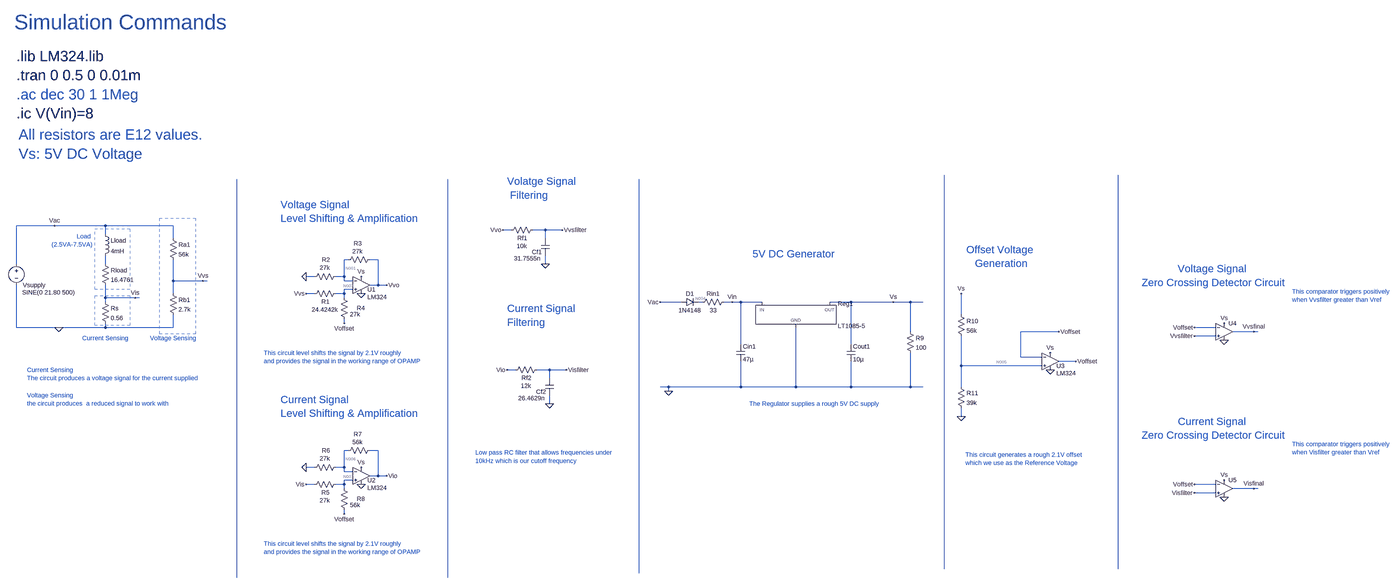
[diagram p0: schematic LTspice.asc, whole sheet]
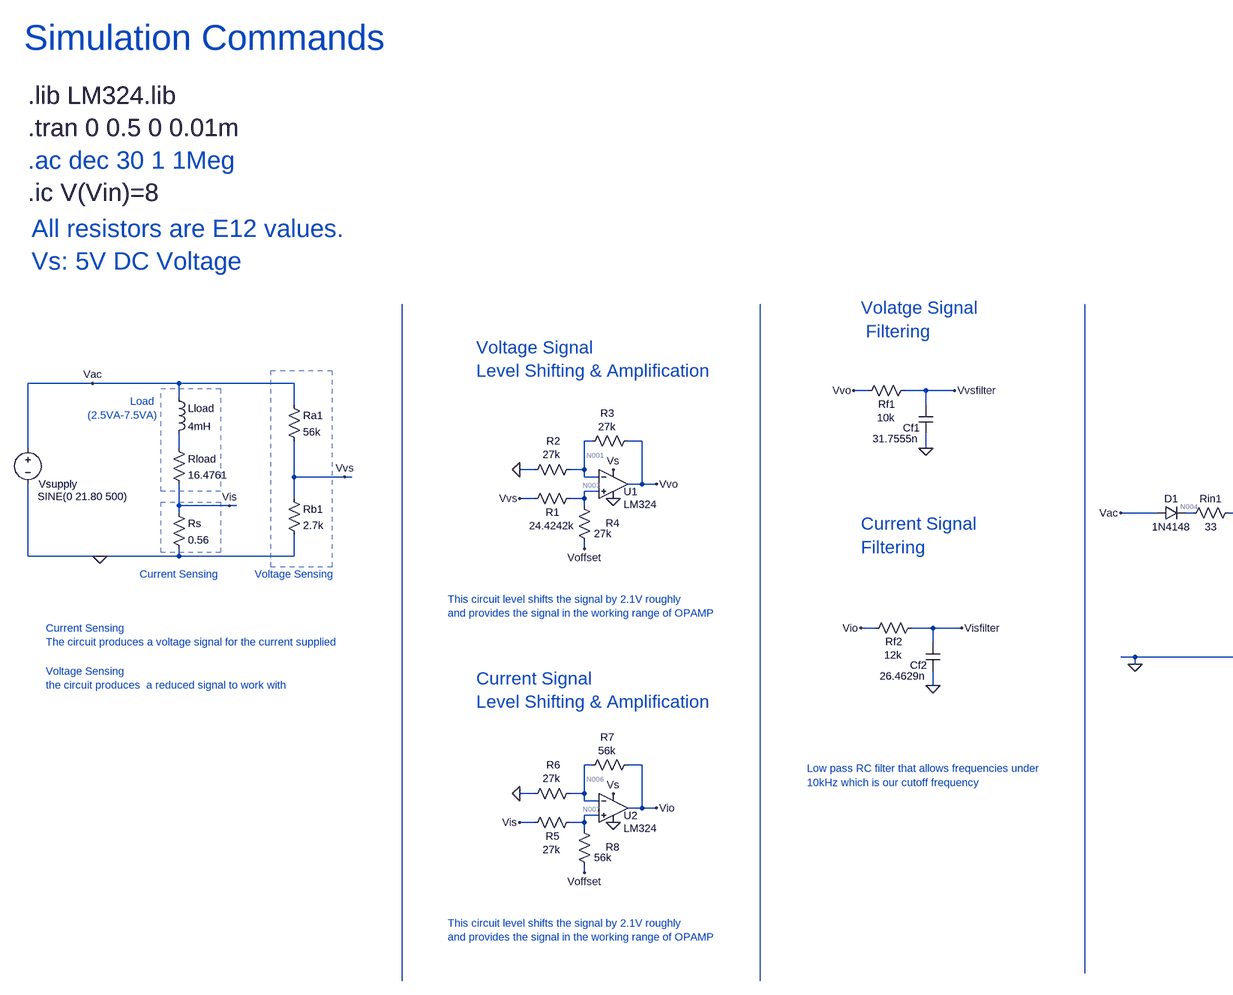
[diagram p1: schematic LTspice.asc, part, row 1 of 1, column 1 of 2]
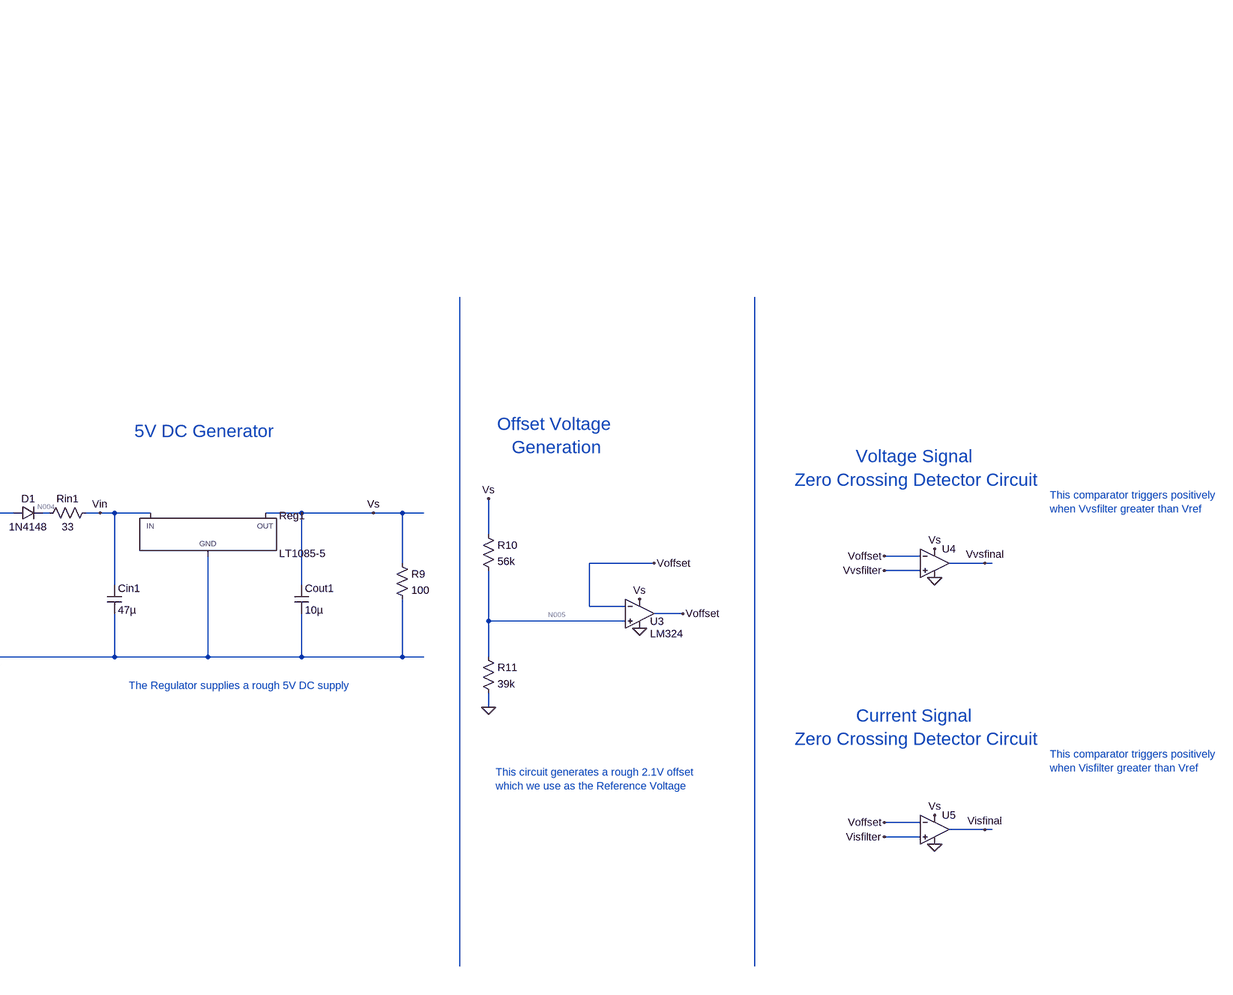
[diagram p2: schematic LTspice.asc, part, row 1 of 1, column 2 of 2]
LTspice.asc, the LTspice schematic file:
Version 4
SHEET 1 5904 1304
WIRE -96 -48 -240 -48
WIRE 96 -48 -96 -48
WIRE 352 -48 96 -48
WIRE 1856 -32 1824 -32
WIRE 1984 -32 1936 -32
WIRE 2048 -32 1984 -32
WIRE 96 -16 96 -48
WIRE 352 0 352 -48
WIRE 1984 0 1984 -32
WIRE 1088 80 1072 80
WIRE 1200 80 1168 80
WIRE -240 96 -240 -48
WIRE 96 96 96 64
WIRE 1984 96 1984 64
WIRE 960 144 928 144
WIRE 1072 144 1072 80
WIRE 1072 144 1040 144
WIRE 352 160 352 80
WIRE 464 160 352 160
WIRE 480 160 464 160
WIRE 1072 160 1072 144
WIRE 1104 160 1072 160
WIRE 1200 176 1200 80
WIRE 1200 176 1168 176
WIRE 1232 176 1200 176
WIRE 1104 192 1072 192
WIRE 352 208 352 160
WIRE 960 208 928 208
WIRE 1072 208 1072 192
WIRE 1072 208 1040 208
WIRE 96 224 96 176
WIRE 208 224 96 224
WIRE 224 224 208 224
WIRE 1072 224 1072 208
WIRE 96 240 96 224
WIRE 2544 240 2464 240
WIRE 2624 240 2608 240
WIRE 2736 240 2704 240
WIRE 2768 240 2736 240
WIRE 2848 240 2768 240
WIRE 3184 240 3104 240
WIRE 3344 240 3184 240
WIRE 3408 240 3344 240
WIRE 3456 240 3408 240
WIRE 3600 288 3600 208
WIRE 1072 320 1072 304
WIRE -240 336 -240 176
WIRE -80 336 -240 336
WIRE 96 336 96 320
WIRE 96 336 -80 336
WIRE 352 336 352 288
WIRE 352 336 96 336
WIRE 4560 336 4480 336
WIRE 3408 352 3408 240
WIRE 3968 352 3824 352
WIRE 4704 352 4624 352
WIRE 4720 352 4704 352
WIRE 4560 368 4480 368
WIRE 2768 400 2768 240
WIRE 3184 400 3184 240
WIRE 3824 448 3824 352
WIRE 3904 448 3824 448
WIRE 4032 464 3968 464
WIRE 3600 480 3600 368
WIRE 3904 480 3600 480
WIRE 1872 496 1840 496
WIRE 2000 496 1952 496
WIRE 2064 496 2000 496
WIRE 2000 528 2000 496
WIRE 2496 560 2464 560
WIRE 2768 560 2768 464
WIRE 2768 560 2496 560
WIRE 2976 560 2976 336
WIRE 2976 560 2768 560
WIRE 3184 560 3184 464
WIRE 3184 560 2976 560
WIRE 3408 560 3408 432
WIRE 3408 560 3184 560
WIRE 3456 560 3408 560
WIRE 3600 560 3600 480
WIRE 2496 576 2496 560
WIRE 2000 624 2000 592
WIRE 3600 672 3600 640
WIRE 1088 800 1072 800
WIRE 1200 800 1168 800
WIRE 960 864 928 864
WIRE 1072 864 1072 800
WIRE 1072 864 1040 864
WIRE 1072 880 1072 864
WIRE 1104 880 1072 880
WIRE 1200 896 1200 800
WIRE 1200 896 1168 896
WIRE 1232 896 1200 896
WIRE 1104 912 1072 912
WIRE 960 928 928 928
WIRE 1072 928 1072 912
WIRE 1072 928 1040 928
WIRE 4560 928 4480 928
WIRE 1072 944 1072 928
WIRE 4704 944 4624 944
WIRE 4720 944 4704 944
WIRE 4560 960 4480 960
WIRE 1072 1040 1072 1024
WIRE 3536 1248 3536 -240
WIRE 4192 1248 4192 -240
WIRE 2384 1264 2384 -224
WIRE 592 1280 592 -224
WIRE 1616 1280 1616 -224
FLAG -80 336 0
FLAG -96 -48 Vac
FLAG 208 224 Vis
FLAG 464 160 Vvs
FLAG 1136 208 0
FLAG 1136 144 Vs
FLAG 928 208 Vvs
FLAG 1072 320 Voffset
FLAG 928 144 0
FLAG 1232 176 Vvo
FLAG 1136 928 0
FLAG 1136 864 Vs
FLAG 928 928 Vis
FLAG 1072 1040 Voffset
FLAG 928 864 0
FLAG 1232 896 Vio
FLAG 1984 96 0
FLAG 1824 -32 Vvo
FLAG 2048 -32 Vvsfilter
FLAG 2000 624 0
FLAG 1840 496 Vio
FLAG 2064 496 Visfilter
FLAG 3600 208 Vs
FLAG 4592 384 0
FLAG 4592 320 Vs
FLAG 4480 368 Vvsfilter
FLAG 4480 336 Voffset
FLAG 4704 352 Vvsfinal
FLAG 2496 576 0
FLAG 2464 240 Vac
FLAG 3344 240 Vs
FLAG 2736 240 Vin
FLAG 3936 496 0
FLAG 3936 432 Vs
FLAG 3600 672 0
FLAG 4032 464 Voffset
FLAG 4592 976 0
FLAG 4592 912 Vs
FLAG 4480 960 Visfilter
FLAG 4480 928 Voffset
FLAG 4704 944 Visfinal
FLAG 3968 352 Voffset
SYMBOL voltage -240 80 R0
WINDOW 0 24 96 Left 2
WINDOW 3 22 124 Left 2
WINDOW 123 0 0 Left 0
WINDOW 39 0 0 Left 0
SYMATTR InstName Vsupply
SYMATTR Value SINE(0 21.80 500)
SYMBOL res 80 80 R0
SYMATTR InstName Rload
SYMATTR Value 16.4761
SYMBOL ind 80 -32 R0
SYMATTR InstName Lload
SYMATTR Value 4mH
SYMBOL res 80 224 R0
SYMATTR InstName Rs
SYMATTR Value 0.56
SYMBOL res 336 -16 R0
SYMATTR InstName Ra1
SYMATTR Value 56k
SYMBOL res 336 192 R0
SYMATTR InstName Rb1
SYMATTR Value 2.7k
SYMBOL Opamps/opamp2 1136 112 R0
WINDOW 0 23 81 Left 2
WINDOW 3 23 109 Left 2
SYMATTR InstName U1
SYMATTR Value LM324
SYMBOL res 1056 192 R90
WINDOW 0 62 55 VBottom 2
WINDOW 3 61 57 VTop 2
SYMATTR InstName R1
SYMATTR Value 24.4242k
SYMBOL res 1056 128 R90
WINDOW 0 -32 53 VBottom 2
WINDOW 3 -33 57 VTop 2
SYMATTR InstName R2
SYMATTR Value 27k
SYMBOL res 1184 64 R90
WINDOW 0 -30 61 VBottom 2
WINDOW 3 -31 62 VTop 2
SYMATTR InstName R3
SYMATTR Value 27k
SYMBOL res 1088 320 R180
WINDOW 0 -62 57 Left 2
WINDOW 3 -44 34 Left 2
SYMATTR InstName R4
SYMATTR Value 27k
SYMBOL Opamps/opamp2 1136 832 R0
WINDOW 0 23 81 Left 2
WINDOW 3 23 109 Left 2
SYMATTR InstName U2
SYMATTR Value LM324
SYMBOL res 1056 912 R90
WINDOW 0 62 55 VBottom 2
WINDOW 3 61 57 VTop 2
SYMATTR InstName R5
SYMATTR Value 27k
SYMBOL res 1056 848 R90
WINDOW 0 -32 53 VBottom 2
WINDOW 3 -33 57 VTop 2
SYMATTR InstName R6
SYMATTR Value 27k
SYMBOL res 1184 784 R90
WINDOW 0 -30 61 VBottom 2
WINDOW 3 -31 62 VTop 2
SYMATTR InstName R7
SYMATTR Value 56k
SYMBOL res 1088 1040 R180
WINDOW 0 -62 57 Left 2
WINDOW 3 -44 34 Left 2
SYMATTR InstName R8
SYMATTR Value 56k
SYMBOL res 1952 -48 R90
WINDOW 0 62 55 VBottom 2
WINDOW 3 61 57 VTop 2
SYMATTR InstName Rf1
SYMATTR Value 10k
SYMBOL cap 2000 64 R180
WINDOW 0 29 13 Left 2
WINDOW 3 33 -11 Left 2
SYMATTR InstName Cf1
SYMATTR Value 31.7555n
SYMBOL res 1968 480 R90
WINDOW 0 62 55 VBottom 2
WINDOW 3 61 57 VTop 2
SYMATTR InstName Rf2
SYMATTR Value 12k
SYMBOL cap 2016 592 R180
WINDOW 0 29 13 Left 2
WINDOW 3 33 -11 Left 2
SYMATTR InstName Cf2
SYMATTR Value 26.4629n
SYMBOL OpAmps/UniversalOpAmp2 4592 352 R0
SYMATTR InstName U4
SYMBOL PowerProducts/LT1085-5 2976 240 R0
SYMATTR InstName Reg1
SYMBOL res 2720 224 R90
WINDOW 0 0 56 VBottom 2
WINDOW 3 32 56 VTop 2
SYMATTR InstName Rin1
SYMATTR Value 33
SYMBOL diode 2544 256 R270
WINDOW 0 32 32 VTop 2
WINDOW 3 0 32 VBottom 2
SYMATTR InstName D1
SYMATTR Value 1N4148
SYMBOL cap 2752 400 R0
SYMATTR InstName Cin1
SYMATTR Value 47µ
SYMATTR SpiceLine Rser=0.001
SYMBOL cap 3168 400 R0
SYMATTR InstName Cout1
SYMATTR Value 10µ
SYMATTR SpiceLine Rser=0.001
SYMBOL res 3392 336 R0
SYMATTR InstName R9
SYMATTR Value 100
SYMBOL Opamps/opamp2 3936 400 R0
WINDOW 0 23 81 Left 2
WINDOW 3 23 109 Left 2
SYMATTR InstName U3
SYMATTR Value LM324
SYMBOL res 3584 272 R0
SYMATTR InstName R10
SYMATTR Value 56k
SYMBOL res 3584 544 R0
SYMATTR InstName R11
SYMATTR Value 39k
SYMBOL OpAmps/UniversalOpAmp2 4592 944 R0
SYMATTR InstName U5
TEXT 48 -8 Right 2 ;Load \n(2.5VA-7.5VA)
TEXT -200 496 Left 2 ;Current Sensing                                \nThe circuit produces a voltage signal for the current supplied
TEXT -200 592 Left 2 ;Voltage Sensing\nthe circuit produces  a reduced signal to work with
TEXT 832 -128 Left 4 ;Voltage Signal \nLevel Shifting & Amplification
TEXT 768 432 Left 2 ;This circuit level shifts the signal by 2.1V roughly \nand provides the signal in the working range of OPAMP
TEXT 768 1152 Left 2 ;This circuit level shifts the signal by 2.1V roughly \nand provides the signal in the working range of OPAMP
TEXT 1840 -216 Left 4 ;Volatge Signal\n Filtering
TEXT 1840 264 Left 4 ;Current Signal\nFiltering
TEXT 1720 808 Left 2 ;Low pass RC filter that allows frequencies under \n10kHz which is our cutoff frequency
TEXT 3752 16 Top 4 ;Offset Voltage \nGeneration
TEXT 3616 816 Left 2 ;This circuit generates a rough 2.1V offset \nwhich we use as the Reference Voltage
TEXT 4552 88 Top 4 ;Voltage Signal \nZero Crossing Detector Circuit
TEXT 2968 32 Top 4 ;5V DC Generator
TEXT 2800 624 Left 2 ;The Regulator supplies a rough 5V DC supply
TEXT 8 376 Left 2 ;Current Sensing
TEXT 264 376 Left 2 ;Voltage Sensing
TEXT 832 608 Left 4 ;Current Signal \nLevel Shifting & Amplification
TEXT -248 -816 Left 6 ;Simulation Commands
TEXT -240 -688 Left 5 !.lib LM324.lib
TEXT -240 -616 Left 5 !.tran 0 0.5 0 0.01m
TEXT -240 -544 Left 5 ;.ac dec 30 1 1Meg
TEXT -240 -472 Left 5 !.ic V(Vin)=8
TEXT 4848 200 Left 2 ;This comparator triggers positively \nwhen Vvsfilter greater than Vref
TEXT 4848 776 Left 2 ;This comparator triggers positively \nwhen Visfilter greater than Vref
TEXT 4552 664 Top 4 ;Current Signal \nZero Crossing Detector Circuit
TEXT -232 -320 Left 5 ;Vs: 5V DC Voltage
TEXT -232 -392 Left 5 ;All resistors are E12 values.
RECTANGLE Normal 300 -76 436 360 2
RECTANGLE Normal 56 -36 188 192 2
RECTANGLE Normal 56 216 188 328 2

The netlist it stands for:
* LTspice.asc
Vsupply Vac 0 SINE(0 21.80 500)
Rload N002 Vis 16.4761
Lload Vac N002 4mH
Rs Vis 0 0.56
Ra1 Vac Vvs 56k
Rb1 Vvs 0 2.7k
XU1 N003 N001 Vs 0 Vvo LM324  ; pins In+ In- V+ V- OUT
R1 N003 Vvs 24.4242k
R2 N001 0 27k
R3 Vvo N001 27k
R4 Voffset N003 27k
XU2 N007 N006 Vs 0 Vio LM324  ; pins In+ In- V+ V- OUT
R5 N007 Vis 27k
R6 N006 0 27k
R7 Vio N006 56k
R8 Voffset N007 56k
Rf1 Vvsfilter Vvo 10k
Cf1 0 Vvsfilter 31.7555n
Rf2 Visfilter Vio 12k
Cf2 0 Visfilter 26.4629n
XU4 Vvsfilter Voffset Vs 0 Vvsfinal level2 Avol=1Meg GBW=10Meg Slew=10Meg Ilimit=25m Rail=0 Vos=0 En=0 Enk=0 In=0 Ink=0 Rin=500Meg  ; pins In+ In- V+ V- OUT
XReg1 0 Vs Vin LT1085-5  ; pins GND OUT IN
Rin1 Vin N004 33
D1 Vac N004 1N4148
Cin1 Vin 0 47µ Rser=0.001
Cout1 Vs 0 10µ Rser=0.001
R9 Vs 0 100
XU3 N005 Voffset Vs 0 Voffset LM324  ; pins In+ In- V+ V- OUT
R10 Vs N005 56k
R11 N005 0 39k
XU5 Visfilter Voffset Vs 0 Visfinal level2 Avol=1Meg GBW=10Meg Slew=10Meg Ilimit=25m Rail=0 Vos=0 En=0 Enk=0 In=0 Ink=0 Rin=500Meg  ; pins In+ In- V+ V- OUT
.model D D
.lib standard.dio
* Load
* (2.5VA-7.5VA)
* Current Sensing
* The circuit produces a voltage signal for the current supplied
* Voltage Sensing
* the circuit produces  a reduced signal to work with
* Voltage Signal
* Level Shifting & Amplification
* This circuit level shifts the signal by 2.1V roughly
* and provides the signal in the working range of OPAMP
* This circuit level shifts the signal by 2.1V roughly
* and provides the signal in the working range of OPAMP
* Volatge Signal
*  Filtering
* Current Signal
* Filtering
* Low pass RC filter that allows frequencies under
* 10kHz which is our cutoff frequency
* Offset Voltage
* Generation
* This circuit generates a rough 2.1V offset
* which we use as the Reference Voltage
* Voltage Signal
* Zero Crossing Detector Circuit
* 5V DC Generator
* The Regulator supplies a rough 5V DC supply
* Current Sensing
* Voltage Sensing
* Current Signal
* Level Shifting & Amplification
* Simulation Commands
.lib LM324.lib
.tran 0 0.5 0 0.01m
* .ac dec 30 1 1Meg
.ic V(Vin)=8
* This comparator triggers positively
* when Vvsfilter greater than Vref
* This comparator triggers positively
* when Visfilter greater than Vref
* Current Signal
* Zero Crossing Detector Circuit
* Vs: 5V DC Voltage
* All resistors are E12 values.
.lib UniversalOpAmp2.lib
.backanno
.end

* Results of the author's LTspice run, read from the files saved beside the schematic
* Operating Point, zero values left out:
*   V(vis) = 13.41 µV
*   V(vvs) = 97.99 mV
*   V(vvo) = 2.054 V
*   V(vs) = 5.002 V
*   V(n001) = 1.027 V
*   V(n003) = 1.027 V
*   V(voffset) = 2.054 V
*   V(vio) = 2.054 V
*   V(n006) = 668.5 mV
*   V(n007) = 668.5 mV
*   V(vvsfilter) = 2.054 V
*   V(visfilter) = 2.054 V
*   V(vvsfinal) = 5.002 V
*   V(vin) = 8 V
*   V(n004) = 8 V
*   V(n005) = 2.054 V
*   V(visfinal) = 5.002 V
*   I(D1) = -2.528 nA
*   I(Lload) = -813.8 nA
*   I(Rload) = -813.8 nA
*   I(Rs) = 23.94 µA
*   I(Ra1) = -1.75 µA
*   I(Rb1) = 36.29 µA
*   I(R1) = 38.04 µA
*   I(R2) = 38.04 µA
*   I(R3) = 38.02 µA
*   I(R4) = 38.02 µA
*   I(R5) = 24.76 µA
*   I(R6) = 24.76 µA
*   I(R7) = 24.74 µA
*   I(R8) = 24.74 µA
*   I(Rf1) = 893.9 pA
*   I(Rf2) = 893.6 pA
*   I(Rin1) = 2.528 nA
*   I(R9) = 50.02 mA
*   I(R10) = 52.64 µA
*   I(R11) = 52.66 µA
*   I(Vsupply) = 2.566 µA